# EAGLE design modular_expansion_system_base (EAGLE 9.2.1)
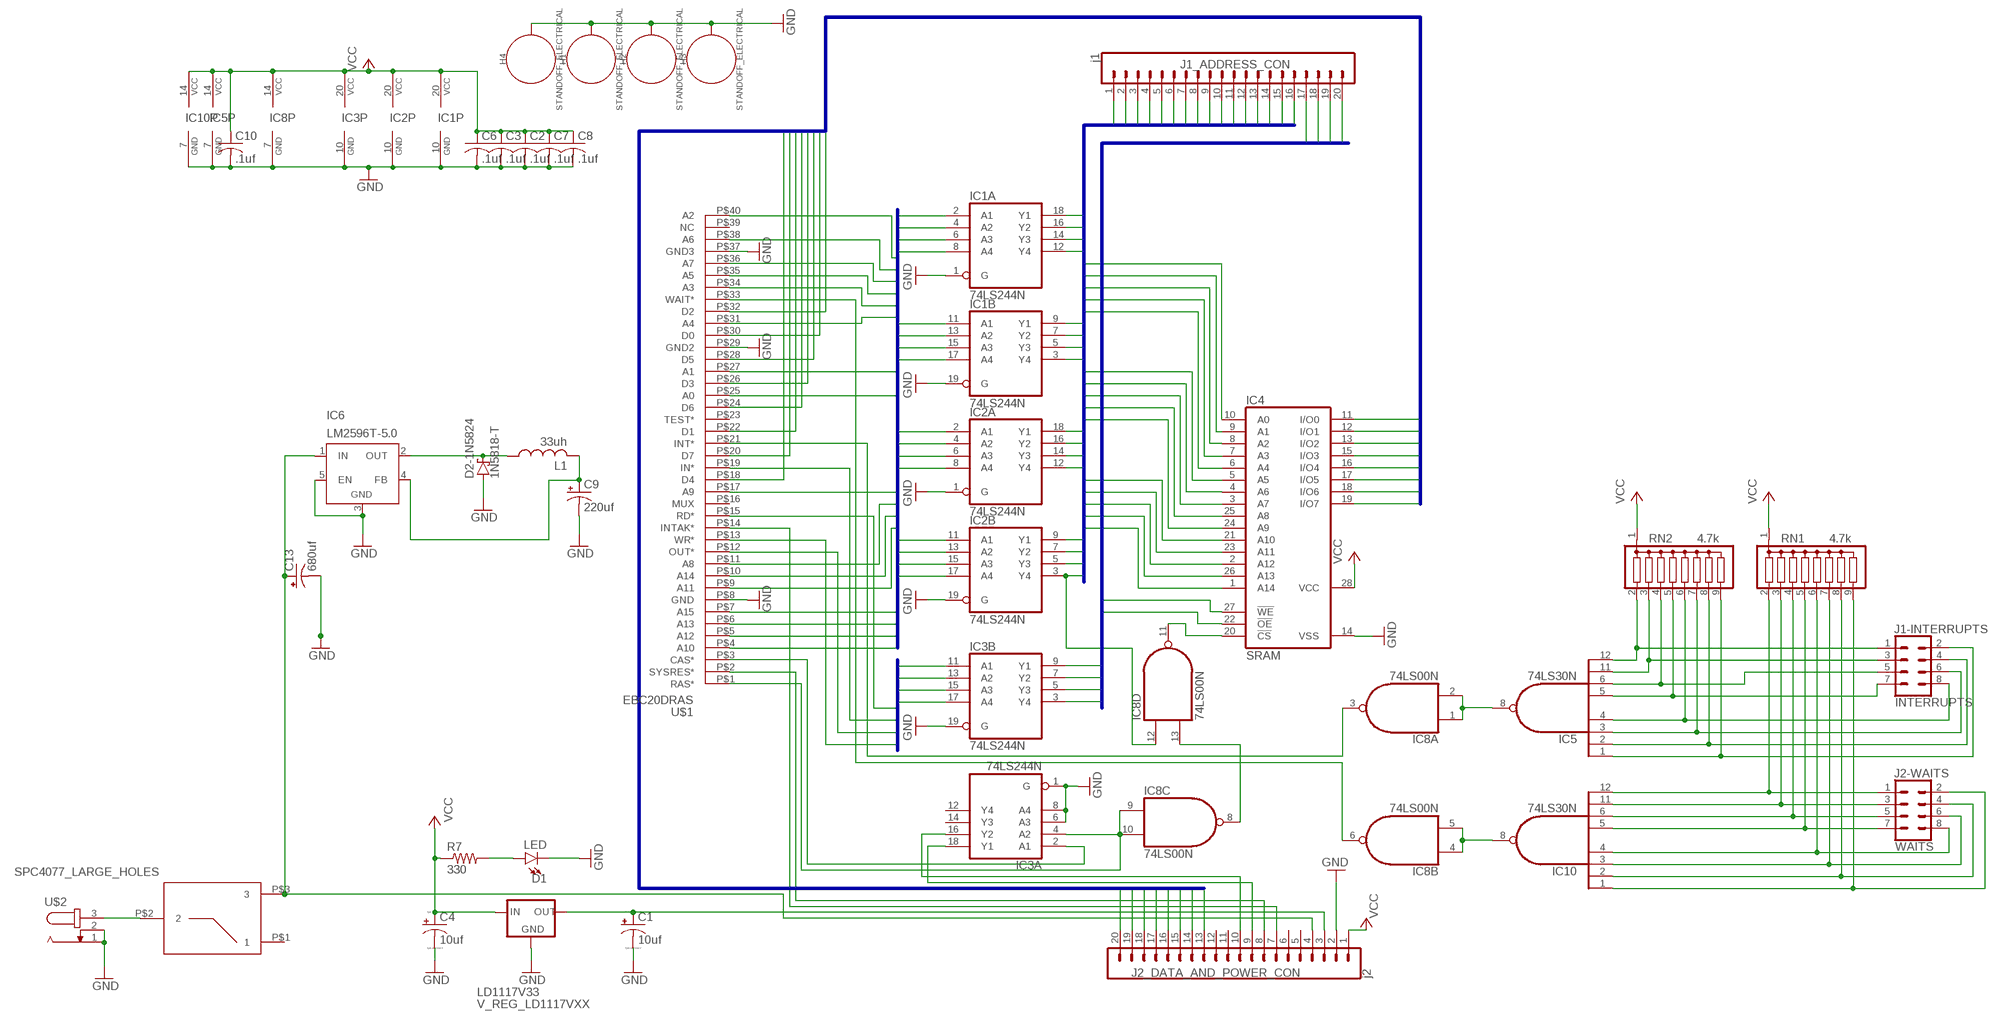
[diagram p0: schematic, sheet 1]

## Parts
C1  10uf  CPOL-USE2.5-5  [E2,5-5]
C2  .1uf  C-US025-025X050  [C025-025X050]
C3  .1uf  C-US025-025X050  [C025-025X050]
C4  10uf  CPOL-USE2.5-5  [E2,5-5]
C6  .1uf  C-US025-025X050  [C025-025X050]
C7  .1uf  C-US025-025X050  [C025-025X050]
C8  .1uf  C-US025-025X050  [C025-025X050]
C9  220uf  CPOL-USE2.5-5  [E2,5-5]
C10  .1uf  C-US025-025X050  [C025-025X050]
C13  680uf  CPOL-USE3.5-8  [E3,5-8]
D1  LED  LED3MM  [LED_3MM]
D2-1N5824  1N5818-T  [DO41-7.6]
H1  STANDOFF_ELECTRICAL  [STANDOFF-ELECTRICAL]
H2  STANDOFF_ELECTRICAL  [STANDOFF-ELECTRICAL]
H3  STANDOFF_ELECTRICAL  [STANDOFF-ELECTRICAL]
H4  STANDOFF_ELECTRICAL  [STANDOFF-ELECTRICAL]
IC1  74LS244N  [DIL20]
IC2  74LS244N  [DIL20]
IC3  74LS244N  [DIL20]
IC4  SRAM  62256P  [DIL28-6]
IC5  74LS30N  [DIL14]
IC6  LM2596T-5.0  LM2596TH  [TO220-52]
IC8  74LS00N  [DIL14]
IC10  74LS30N  [DIL14]
J1-INTERRUPTS  INTERRUPTS  CONN_04X2  [2X4]
J1_ADDRESS_CON  j1  CONN_20  [1X20]
J2-WAITS  WAITS  CONN_04X2  [2X4]
J2_DATA_AND_POWER_CON  j2  CONN_20  [1X20]
L1  33uh  L-US6000-XXX-RC  [6000-XXXX-RC]
LD1117V33  V_REG_LD1117VXX  [78XXL]
R7  330  R-US_0309/V  [0309V]
RN1  4.7k  G08R  [SIL9]
RN2  4.7k  G08R  [SIL9]
SW1  100SP3T1B1M6QE  [100SP3T1B1M6QE]
U$1  EBC20DRAS  [EBC20DRAS]
U$2  SPC4077_LARGE_HOLES  [SPC4077]

## Nets
5V_FROM_SWITCHER: C9.+ IC6.4(FB) L1.2
9V-IN: SW1.P$2 U$2.3
9V-POST-SW: C13.+ IC6.1(IN) J2_DATA_AND_POWER_CON.4 SW1.P$3
A0: IC1.2(A:A1) U$1.P$25(A0)
A1: IC1.4(A:A2) U$1.P$27(A1)
A2: IC1.6(A:A3) U$1.P$40(A2)
A3: IC1.8(A:A4) U$1.P$34(A3)
A4: IC1.11(B:A1) U$1.P$31(A4)
A5: IC1.13(B:A2) U$1.P$35(A5)
A6: IC1.15(B:A3) U$1.P$38(A6)
A7: IC1.17(B:A4) U$1.P$36(A7)
A8: IC2.2(A:A1) U$1.P$11(A8)
A9: IC2.4(A:A2) U$1.P$17(A9)
A10: IC2.6(A:A3) U$1.P$4(A10)
A11: IC2.8(A:A4) U$1.P$9(A11)
A12: IC2.11(B:A1) U$1.P$5(A12)
A13: IC2.13(B:A2) U$1.P$6(A13)
A14: IC2.15(B:A3) U$1.P$10(A14)
A15: IC2.17(B:A4) U$1.P$7(A15)
A15_AND_RAS: IC4.20(!CS) IC8.11(D:O)
BUFFERED_A0: IC1.18(A:Y1) IC4.10(A0) J1_ADDRESS_CON.1
BUFFERED_A1: IC1.16(A:Y2) IC4.9(A1) J1_ADDRESS_CON.2
BUFFERED_A2: IC1.14(A:Y3) IC4.8(A2) J1_ADDRESS_CON.3
BUFFERED_A3: IC1.12(A:Y4) IC4.7(A3) J1_ADDRESS_CON.4
BUFFERED_A4: IC1.9(B:Y1) IC4.6(A4) J1_ADDRESS_CON.5
BUFFERED_A5: IC1.7(B:Y2) IC4.5(A5) J1_ADDRESS_CON.6
BUFFERED_A6: IC1.5(B:Y3) IC4.4(A6) J1_ADDRESS_CON.7
BUFFERED_A7: IC1.3(B:Y4) IC4.3(A7) J1_ADDRESS_CON.8
BUFFERED_A8: IC2.18(A:Y1) IC4.25(A8) J1_ADDRESS_CON.9
BUFFERED_A9: IC2.16(A:Y2) IC4.24(A9) J1_ADDRESS_CON.10
BUFFERED_A10: IC2.14(A:Y3) IC4.21(A10) J1_ADDRESS_CON.11
BUFFERED_A11: IC2.12(A:Y4) IC4.23(A11) J1_ADDRESS_CON.12
BUFFERED_A12: IC2.9(B:Y1) IC4.2(A12) J1_ADDRESS_CON.13
BUFFERED_A13: IC2.7(B:Y2) IC4.26(A13) J1_ADDRESS_CON.14
BUFFERED_A14: IC2.5(B:Y3) IC4.1(A14) J1_ADDRESS_CON.15
BUFFERED_A15: IC2.3(B:Y4) IC8.12(D:I0) J1_ADDRESS_CON.16
BUFFERED_CAS*: IC3.18(A:Y1) J2_DATA_AND_POWER_CON.9
BUFFERED_IN*: IC3.5(B:Y3) J1_ADDRESS_CON.17
BUFFERED_OUT*: IC3.3(B:Y4) J1_ADDRESS_CON.18
BUFFERED_RAS*: IC3.16(A:Y2) J2_DATA_AND_POWER_CON.10
BUFFERED_RD*: IC3.9(B:Y1) IC4.22(!OE) J1_ADDRESS_CON.19
BUFFERED_WR*: IC3.7(B:Y2) IC4.27(!WE) J1_ADDRESS_CON.20
CAS*: IC3.2(A:A1) U$1.P$3(CAS*)
D0: IC4.11(I/O0) J2_DATA_AND_POWER_CON.20 U$1.P$30(D0)
D1: IC4.12(I/O1) J2_DATA_AND_POWER_CON.19 U$1.P$22(D1)
D2: IC4.13(I/O2) J2_DATA_AND_POWER_CON.18 U$1.P$32(D2)
D3: IC4.15(I/O3) J2_DATA_AND_POWER_CON.17 U$1.P$26(D3)
D4: IC4.16(I/O4) J2_DATA_AND_POWER_CON.16 U$1.P$18(D4)
D5: IC4.17(I/O5) J2_DATA_AND_POWER_CON.15 U$1.P$28(D5)
D6: IC4.18(I/O6) J2_DATA_AND_POWER_CON.14 U$1.P$24(D6)
D7: IC4.19(I/O7) J2_DATA_AND_POWER_CON.13 U$1.P$20(D7)
GND: C1.- C2.2 C3.2 C4.- C6.2 C7.2 C8.2 C9.- C10.2 C13.- D1.K(C) D2-1N5824.A H1.P1 H2.P1 H3.P1 H4.P1 IC1.1(A:G) IC1.10(P:GND) IC1.19(B:G) IC2.1(A:G) IC2.10(P:GND) IC2.19(B:G) IC3.1(A:G) IC3.6(A:A3) IC3.8(A:A4) IC3.10(P:GND) IC3.19(B:G) IC4.14(VSS) IC5.7(GND) IC6.3(GND) IC6.5(EN) IC8.7(P:GND) IC10.7(GND) J2_DATA_AND_POWER_CON.2 LD1117V33.IN(GND) U$1.P$8(GND) U$1.P$29(GND2) U$1.P$37(GND3) U$2.1 U$2.2
IN*: IC3.15(B:A3) U$1.P$19(IN*)
INT: IC5.8(O) IC8.1(A:I0) IC8.2(A:I1)
INT0*: IC5.12(I7) J1-INTERRUPTS.1 RN2.2
INT1*: IC5.11(I6) J1-INTERRUPTS.3 RN2.3
INT2*: IC5.6(I5) J1-INTERRUPTS.5 RN2.4
INT3*: IC5.5(I4) J1-INTERRUPTS.7 RN2.5
INT4*: IC5.1(I0) J1-INTERRUPTS.2 RN2.9
INT5*: IC5.2(I1) J1-INTERRUPTS.4 RN2.8
INT6*: IC5.3(I2) J1-INTERRUPTS.6 RN2.7
INT7*: IC5.4(I3) J1-INTERRUPTS.8 RN2.6
INT*: IC8.3(A:O) U$1.P$21(INT*)
INTAK*: J2_DATA_AND_POWER_CON.7 U$1.P$14(INTAK*)
N$1: D2-1N5824.C IC6.2(OUT) L1.1
N$20: D1.A R7.2
OUT*: IC3.17(B:A4) U$1.P$12(OUT*)
RAS: IC8.8(C:O) IC8.13(D:I1)
RAS*: IC3.4(A:A2) IC8.9(C:I0) IC8.10(C:I1) U$1.P$1(RAS*)
RD*: IC3.11(B:A1) U$1.P$15(RD*)
SYSRES*: J2_DATA_AND_POWER_CON.8 U$1.P$2(SYSRES*)
VCC: C2.1 C3.1 C4.+ C6.1 C7.1 C8.1 C10.1 IC1.20(P:VCC) IC2.20(P:VCC) IC3.20(P:VCC) IC4.28(VCC) IC5.14(VCC) IC8.14(P:VCC) IC10.14(VCC) J2_DATA_AND_POWER_CON.1 LD1117V33.OUT(IN) R7.1 RN1.1 RN2.1
VCC/2: C1.+ J2_DATA_AND_POWER_CON.3 LD1117V33.GND(OUT)
WAIT: IC8.4(B:I0) IC8.5(B:I1) IC10.8(O)
WAIT0*: IC10.4(I3) J2-WAITS.8 RN1.6
WAIT1*: IC10.3(I2) J2-WAITS.6 RN1.7
WAIT2*: IC10.2(I1) J2-WAITS.4 RN1.8
WAIT3*: IC10.1(I0) J2-WAITS.2 RN1.9
WAIT4*: IC10.5(I4) J2-WAITS.7 RN1.5
WAIT5*: IC10.6(I5) J2-WAITS.5 RN1.4
WAIT6*: IC10.11(I6) J2-WAITS.3 RN1.3
WAIT7*: IC10.12(I7) J2-WAITS.1 RN1.2
WAIT*: IC8.6(B:O) U$1.P$33(WAIT*)
WR*: IC3.13(B:A2) U$1.P$13(WR*)
Unconnected: IC3.12(A:Y4) IC3.14(A:Y3) J2_DATA_AND_POWER_CON.5 J2_DATA_AND_POWER_CON.6 J2_DATA_AND_POWER_CON.11 J2_DATA_AND_POWER_CON.12 SW1.P$1 U$1.P$16(MUX) U$1.P$23(TEST*) U$1.P$39(NC)

## Buses
DATABUS:D0,D1,D2,D3,D4,D5,D6,D7
CNTRL:IN*,OUT*,RD*,WR*
CONTROL:BUFFERED_IN*,BUFFERED_OUT*,BUFFERED_RD*,BUFFERED_WR*
BUFFERED:BUFFERED_A0,BUFFERED_A1,BUFFERED_A2,BUFFERED_A3,BUFFERED_A4,BUFFERED_A5,BUFFERED_A6,BUFFERED_A7,BUFFERED_A8,BUFFERED_A9,BUFFERED_A10,BUFFERED_A11,BUFFERED_A12,BUFFERED_A13,BUFFERED_A14,BUFFERED_A15
A0,A1,A2,A3,A4,A5,A6,A7,A8,A9,A10,A11,A12,A13,A14,A15

## Library data of the parts
C1 C4 = resistor:CPOL-US: POLARIZED CAPACITOR, American symbol
C2 C3 C6-C8 C10 = rcl:C-US: CAPACITOR, American symbol; SPICEPREFIX: C
C9 C13 = rcl:CPOL-US: POLARIZED CAPACITOR, American symbol; SPICEPREFIX: C
D1 = SparkFun-LED:LED: LED (Generic) Standard schematic elements and footprints for 5mm, 3mm, 1206, and 0603 sized LEDs. Generic LEDs with no color specified.; PROD_ID: DIO-08794
D2-1N5824 = diode:1N581*: 1.0A SCHOTTKY BARRIER RECTIFIER Source: http://www.diodes.com/datasheets/ds23001.pdf
H1-H4 = SparkFun-Hardware:STANDOFF_ELECTRICAL: Stand Off Drill holes with an electrical connection. For example, use these to ground your board to a chassis. Example SparkFun Products Screw - Phillips Head (1/4", 4-40, 10 pack) <https://www.sparkfun.com/products/10453> (PRT-10453) Screw - Phillips Head (1/2", 4-40, 10 pack) <https://www.sparkfun.com/products/10452> (PRT-10452) Screw - Phillips Head (3/4", 4-40, 10 pack) <https://www.sparkfun.com/products/10451> (PRT-10451) Screw - Phillips Head (1", 4-40, 10 pack) <https://www.sparkfun.com/products/10450> (PRT-10450)
IC1-IC3 = 74xx-us:74*244: Octal BUFFER and LINE DRIVER, 3-state
IC4 = memory-hitachi:62256P: MEMORY; OC_FARNELL: unknown; OC_NEWARK: unknown
IC5 IC10 = 74xx-us:74*30: 8-input NAND gate
IC6 = linear:LM2596T: STEP-DOWN VOLTAGE REGULATOR
IC8 = 74xx-us:74*00: Quad 2-input NAND gate
J1-INTERRUPTS J2-WAITS = SparkFun-Connectors:CONN_04X2: Multi connection point. Often used as Generic Header-pin footprint for 0.1 inch spaced/style header connections On any of the 0.1 inch spaced packages, you can populate with these: Break Away Headers - Straight <https://www.sparkfun.com/products/116> (PRT-00116) Break Away Male Headers - Right Angle <https://www.sparkfun.com/products/553> (PRT-00553) Female Headers <https://www.sparkfun.com/products/115> (PRT-00115) Break Away Headers - Machine Pin <https://www.sparkfun.com/products/117> (PRT-00117) Break Away Female Headers - Swiss Machine Pin <https://www.sparkfun.com/products/743> (PRT-00743)
J1_ADDRESS_CON J2_DATA_AND_POWER_CON = SparkFun-Connectors:CONN_20: Multi connection point. Often used as Generic Header-pin footprint for 0.1 inch spaced/style header connections On any of the 0.1 inch spaced packages, you can populate with these: Break Away Headers - Straight <https://www.sparkfun.com/products/116> (PRT-00116) Break Away Male Headers - Right Angle <https://www.sparkfun.com/products/553> (PRT-00553) Female Headers <https://www.sparkfun.com/products/115> (PRT-00115) Break Away Headers - Machine Pin <https://www.sparkfun.com/products/117> (PRT-00117) Break Away Female Headers - Swiss Machine Pin <https://www.sparkfun.com/products/743> (PRT-00743) For SCREWTERMINALS and SPRING TERMINALS visit here: Screw Terimnals on SparkFun.com <https://www.sparkfun.com/search/results?term=Screw+Terminals> (5mm/3.5mm/2.54mm spacing) This device is also useful as a general connection point to wire up your design to another part of your project. Our various solder wires solder well into these plated through hole pads. Hook-Up Wire - Assortment (Stranded, 22 AWG) <https://www.sparkfun.com/products/11375> (PRT-11375) Hook-Up Wire - Assortment (Solid Core, 22 AWG) <https://www.sparkfun.com/products/11367> (PRT-11367) View the entire wire category on our website here <https://www.sparkfun.com/categories/141> Special notes: Molex polarized connector foot print use with SKU : PRT-08231 with associated crimp pins and housings. 1MM SMD Version SKU: PRT-10208 NOTES ON THE VARIANTS LOCK and LOCK_LONGPADS... This footprint was designed to help hold the alignment of a through-hole component (i.e. 6-pin header) while soldering it into place. You may notice that each hole has been shifted either up or down by 0.005 of an inch from it's more standard position (which is a perfectly straight line). This slight alteration caused the pins (the squares in the middle) to touch the edges of the holes. Because they are alternating, it causes a "brace" to hold the component in place. 0.005 has proven to be the perfect amount of "off-center" position when using our standard breakaway headers. Although looks a little odd when you look at the bare footprint, once you have a header in there, the alteration is very hard to notice. Also,if you push a header all the way into place, it is covered up entirely on the bottom side. Note about LOCK SPECIAL package: This is just like the LOCK variant in that the holes are staggared by 5 mil, but except for the last two holes. They are not altered from the "standard" footprint layout. This is used for a special purpose on the layout of our Graphic LCD Backpack. Make sure you want to use this device before selecting it for you project!
L1 = rcl:L-US: INDUCTOR, American symbol; SPICEPREFIX: L
LD1117V33 = SparkFun-IC-Power:V_REG_LD1117VXX: LD1117VXX voltage regulator. We carry the 3.3V version (COM-00526) in TO-220 package.
R7 = resistor:R-US_: RESISTOR, American symbol
RN1 RN2 = resistor-sil:G08R: SIL RESISTOR; OC_FARNELL: unknown; OC_NEWARK: unknown
SW1 = TMS99:100SP3T1B1M6QE
U$1 = TMS99:EBC20DRAS
U$2 = con-jack:SPC4077_LARGE_HOLES

## Net classes
0 default: width 0.3 mm

## Board
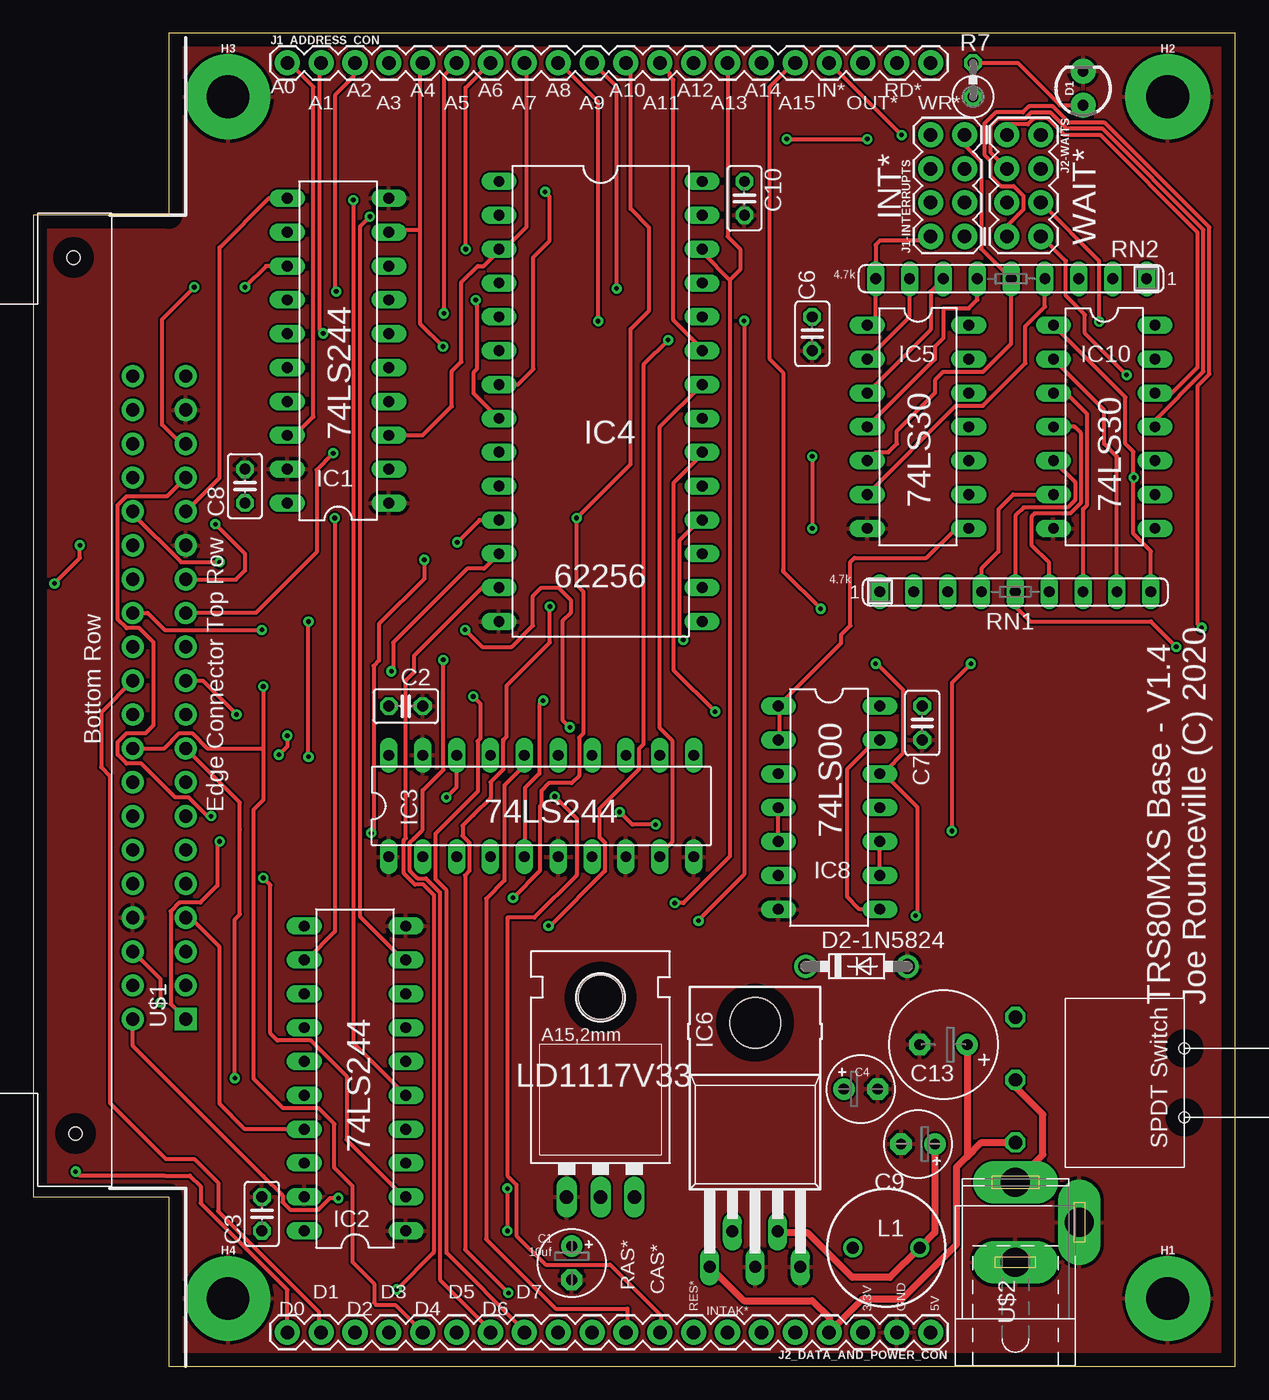
[diagram p1: board, top side]
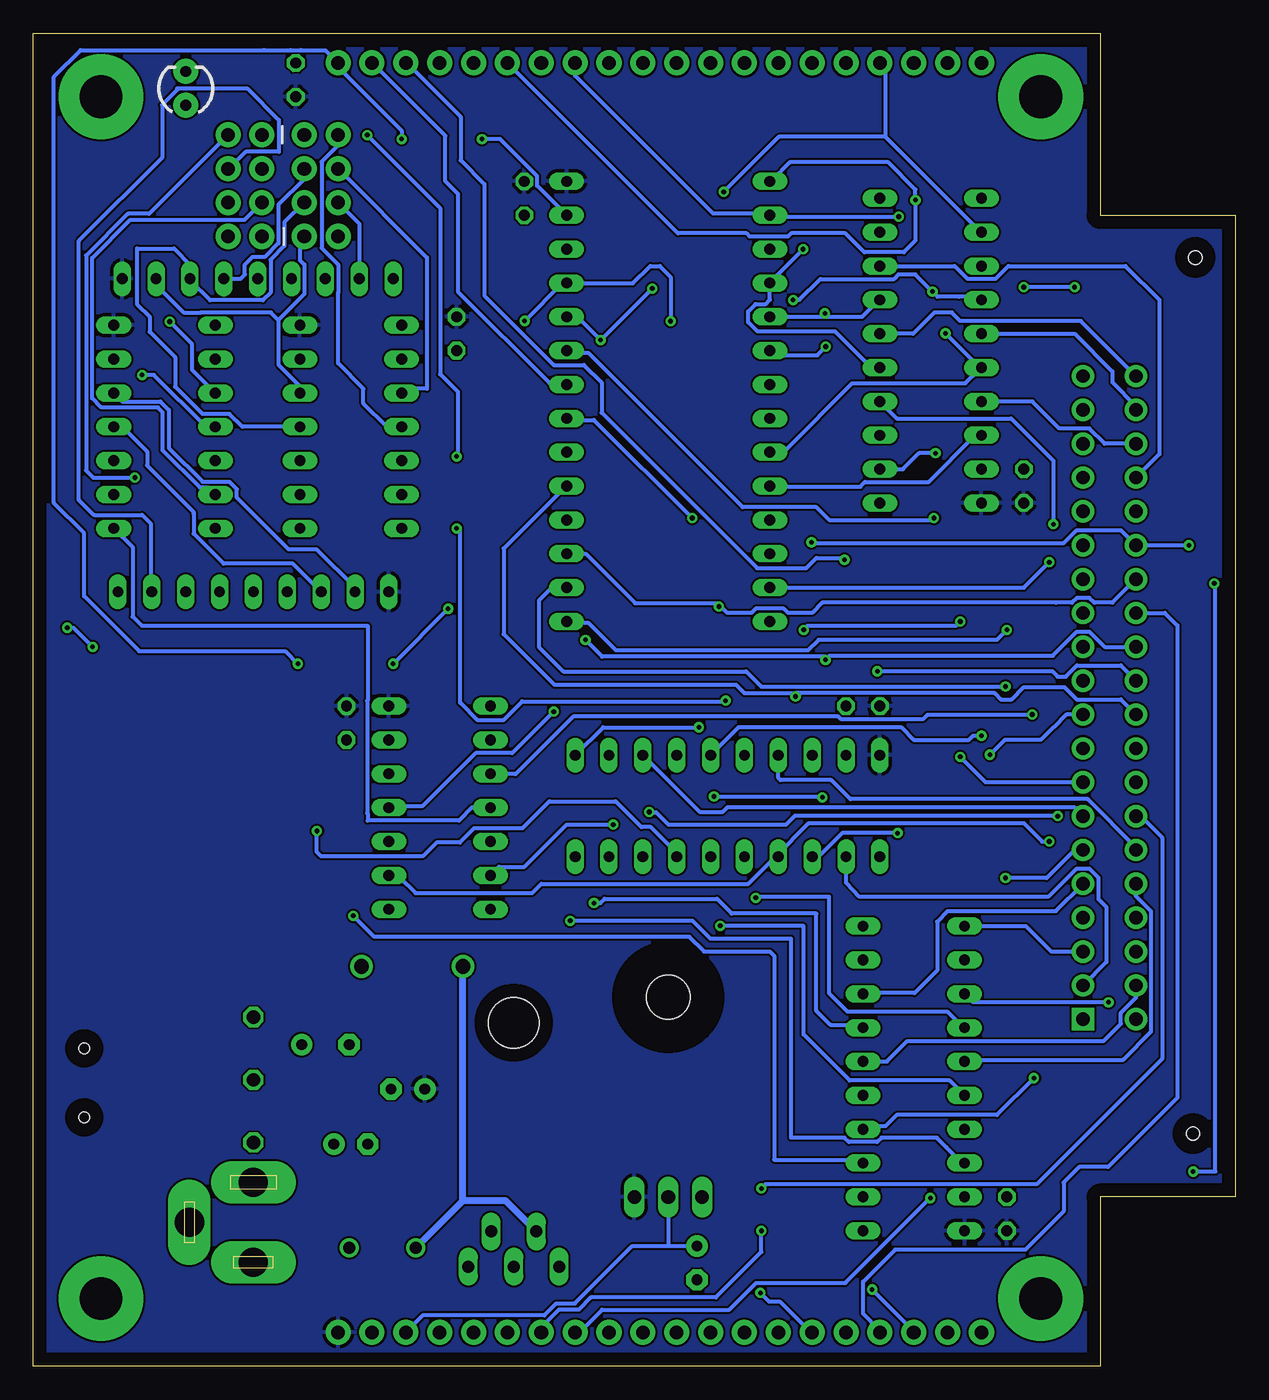
[diagram p2: board, bottom side, seen from below]

Size 90.17 x 100.01 mm. Coordinates in mm from the lower left corner, seen from the top.
Outline: 90.17,100.01 10.16,100.01 10.16,86.36 0,86.36 0,12.7 10.16,12.7 10.16,0 90.17,0 90.17,100.01
Copper layers (1*16): Top 0.035mm / dielectric 1.5mm / Bottom 0.035mm
Design rules "default": minimum track width 6mil, minimum drill 0.35mm, track to track 6mil, track to pad 6mil, pad to pad 6mil, via to via 6mil, smd to smd 6mil, copper to edge 40mil, drill to drill 6mil, minimum pad ring 10mil, minimum via ring 8mil, stop-mask expansion 4mil, vias tented up to drill 0mil, thermal gap 10mil

### Footprints (pad centres in the part's own frame; a part is rotated, then mirrored left to right if it is on the bottom)
E2,5-5 = drill 0.813 pad 1.6: + -1.27,0 | drill 0.813 pad 1.6 octagon: - 1.27,0
C025-025X050 = drill 0.813 octagon: 1 -1.27,0; 2 1.27,0
E3,5-8 = drill 0.813 pad 1.6: + -1.778,0 | drill 0.813 pad 1.6 octagon: - 1.778,0
LED_3MM = drill 0.813 pad 1.88: A -1.27,0; K 1.27,0
DO41-7.6 = drill 1.1 pad 1.7: A 3.81,0; C -3.81,0
STANDOFF-ELECTRICAL = drill 3.2 pad 6.35: P1 0,0
DIL20 = drill 0.813 long: 1 -11.43,-3.81; 2 -8.89,-3.81; 3 -6.35,-3.81; 4 -3.81,-3.81; 5 -1.27,-3.81; 6 1.27,-3.81; 7 3.81,-3.81; 8 6.35,-3.81; 9 8.89,-3.81; 10 11.43,-3.81; 11 11.43,3.81; 12 8.89,3.81; 13 6.35,3.81; 14 3.81,3.81; 15 1.27,3.81; 16 -1.27,3.81; 17 -3.81,3.81; 18 -6.35,3.81; 19 -8.89,3.81; 20 -11.43,3.81
DIL28-6 = drill 0.813 long: 1 -16.51,-7.62; 2 -13.97,-7.62; 3 -11.43,-7.62; 4 -8.89,-7.62; 5 -6.35,-7.62; 6 -3.81,-7.62; 7 -1.27,-7.62; 8 1.27,-7.62; 9 3.81,-7.62; 10 6.35,-7.62; 11 8.89,-7.62; 12 11.43,-7.62; 13 13.97,-7.62; 14 16.51,-7.62; 15 16.51,7.62; 16 13.97,7.62; 17 11.43,7.62; 18 8.89,7.62; 19 6.35,7.62; 20 3.81,7.62; 21 1.27,7.62; 22 -1.27,7.62; 23 -3.81,7.62; 24 -6.35,7.62; 25 -8.89,7.62; 26 -11.43,7.62; 27 -13.97,7.62; 28 -16.51,7.62
DIL14 = drill 0.813 long: 1 -7.62,-3.81; 2 -5.08,-3.81; 3 -2.54,-3.81; 4 0,-3.81; 5 2.54,-3.81; 6 5.08,-3.81; 7 7.62,-3.81; 8 7.62,3.81; 9 5.08,3.81; 10 2.54,3.81; 11 0,3.81; 12 -2.54,3.81; 13 -5.08,3.81; 14 -7.62,3.81
TO220-52 = drill 0.9 long: 1 -3.4,-21.1; 2 -1.7,-18.47; 3 0,-21.1; 4 1.7,-18.47; 5 3.4,-21.1 | hole 3.8: 0,-2.8
2X4 = drill 1.016 pad 1.88: 1 -3.81,-1.27; 2 -3.81,1.27; 3 -1.27,-1.27; 4 -1.27,1.27; 5 1.27,-1.27; 6 1.27,1.27; 7 3.81,-1.27; 8 3.81,1.27
1X20 = drill 1.016 pad 1.88: 1 0,0; 2 2.54,0; 3 5.08,0; 4 7.62,0; 5 10.16,0; 6 12.7,0; 7 15.24,0; 8 17.78,0; 9 20.32,0; 10 22.86,0; 11 25.4,0; 12 27.94,0; 13 30.48,0; 14 33.02,0; 15 35.56,0; 16 38.1,0; 17 40.64,0; 18 43.18,0; 19 45.72,0; 20 48.26,0
6000-XXXX-RC = drill 0.9 pad 1.422: 1 -2.5,0; 2 2.5,0
78XXL = drill 1.016 long: GND 0,-3.81; IN -2.54,-3.81; OUT 2.54,-3.81 | hole 3.302: 0,11.176
0309V = drill 0.813 octagon: 1 -1.27,0; 2 1.27,0
SIL9 = drill 0.813 long: 1 -10.16,0; 2 -7.62,0; 3 -5.08,0; 4 -2.54,0; 5 0,0; 6 2.54,0; 7 5.08,0; 8 7.62,0; 9 10.16,0
100SP3T1B1M6QE = drill 1 octagon: P$1 0,-0.47; P$2 0,4.229; P$3 0,8.928 | hole 0.8: -12.687,7.048; -12.687,1.88
EBC20DRAS = drill 1 pad 1.676 square: P$1 0,0 | drill 1 pad 1.676: P$2 0,3.969; P$3 2.54,0; P$4 2.54,3.969; P$5 5.08,0; P$6 5.08,3.969; P$7 7.62,0; P$8 7.62,3.969; P$9 10.16,0; P$10 10.16,3.969; P$11 12.7,0; P$12 12.7,3.969; P$13 15.24,0; P$14 15.24,3.969; P$15 17.78,0; P$16 17.78,3.969; P$17 20.32,0; P$18 20.32,3.969; P$19 22.86,0; P$20 22.86,3.969; P$21 25.4,0; P$22 25.4,3.969; P$23 27.94,0; P$24 27.94,3.969; P$25 30.48,0; P$26 30.48,3.969; P$27 33.02,0; P$28 33.02,3.969; P$29 35.56,0; P$30 35.56,3.969; P$31 38.1,0; P$32 38.1,3.969; P$33 40.64,0; P$34 40.64,3.969; P$35 43.18,0; P$36 43.18,3.969; P$37 45.72,0; P$38 45.72,3.969; P$39 48.26,0; P$40 48.26,3.969 | hole 1: -8.572,8.255; 57.15,8.414
SPC4077 = drill 2.184 pad 2.184 long: 1 -3,0; 2 0,-4.8; 3 3,0

### Placement (x,y rotation side)
C1  40.39,7.75 270 top
C2  27.94,49.53 0 top
C3  17.14,11.43 90 top
C4  62.07,20.8 0 top
C6  58.42,77.47 270 top
C7  66.67,48.26 270 top
C8  15.88,66.04 90 top
C9  66.36,16.67 180 top
C10  53.34,87.63 270 top
C13  68.26,24.13 180 top
D1  78.74,95.89 90 top
D2-1N5824  61.75,30 0 top
H1  85.09,5.08 0 top
H2  85.09,95.25 0 top
H3  14.61,95.25 0 top
H4  14.61,5.08 0 top
IC1  22.86,76.2 90 top
IC2  24.13,21.59 90 top
IC3  38.1,42.04 0 top
IC4  42.55,72.39 270 top
IC5  66.36,70.48 270 top
IC6  54.13,28.57 0 top
IC8  59.69,41.91 270 top
IC10  80.33,70.48 270 top
J1-INTERRUPTS  68.58,88.58 90 top
J1_ADDRESS_CON  19.05,97.79 0 top
J2-WAITS  74.3,88.58 270 top
J2_DATA_AND_POWER_CON  67.31,2.54 180 top
L1  63.98,8.89 0 top
LD1117V33  42.55,16.51 0 top
R7  70.48,96.52 90 top
RN1  73.66,58.1 0 top
RN2  73.34,81.6 180 top
SW1  73.66,25.72 180 top
U$1  11.43,26.04 90 top
U$2  73.66,10.79 90 top

### Tracks (layer width: path | path; a pad name or v marks a point on that pad's centre or on a via)
5V_FROM_SWITCHER
  Top 0.508: C9.+ 67.63,10.04 L1.2 64.25,6.67 61.44,6.67 58.1,10 55.94,10 IC6.4
9V-IN
  Top 0.508: U$2.3 75.72,15.86 75.72,18.89 73.66,20.95 SW1.P$2
9V-POST-SW
  Top 0.508: IC6.1 53.29,4.92 58.42,4.92 59.69,3.65 J2_DATA_AND_POWER_CON.4 62.2,5.05 65.17,5.05 69.26,9.14 69.26,14.94 70.02,15.71 70.04,15.72 | SW1.P$3 71.11,16.79 70.04,15.72 | C13.+ 70.04,15.72
A0  (via drill 0.35)
  Top 0.3: v22.5,68.5 21.25,67.25 21.25,61.08 16.69,56.52 U$1.P$25
  Bottom 0.3: IC1.2 24.94,67.31 23.75,68.5 v22.5,68.5
A1  (via drill 0.35)
  Top 0.3: U$1.P$27 11.48,59.01 15.19,59.01 15.88,59.69 15.88,60.96 v13.65,63.18
  Bottom 0.3: IC1.4 25.4,71.12 16.83,71.12 13.65,67.94 v13.65,63.18
A2
  Bottom 0.3: IC1.6 24.17,77.47 22.58,79.06 21.27,79.06 20.65,78.43 11.6,78.43 U$1.P$40
A3
  Bottom 0.3: IC1.8 21.07,82.55 20.11,81.59 17.99,81.59 17.03,82.55 8.26,82.55 5.71,80.01 5.71,68.42 U$1.P$34
A4
  Top 0.3: U$1.P$31 13.97,66.67 13.97,83.94 17.66,87.63 IC1.11
A5  (via drill 0.35)
  Top 0.3: U$1.P$35 11.09,69.22 9.65,70.65 9.65,78.55 v12.06,80.96 | IC1.13 17.46,82.55 v15.88,80.96
  Bottom 0.3: v12.06,80.96 v15.88,80.96
A6
  Bottom 0.3: IC1.15 12.06,77.47 9.24,74.64 9.24,73.82 7.46,72.05 U$1.P$38
A7
  Bottom 0.3: U$1.P$36 9.82,69.22 10.96,70.36 13.21,70.36 15.24,72.39 IC1.17
A8  (via drill 0.35)
  Top 0.3: 21.25,24 23.5,21.75 23.5,17 27.75,12.75 IC2.2
  Top 0.305: 21.25,24 20.82,24.43 18.31,24.43 17.78,24.96 17.78,36.1 v17.25,36.63
  Bottom 0.3: U$1.P$11 12.06,38.73 14.16,36.63 v17.25,36.63
A9  (via drill 0.35)
  Top 0.3: 15.49,40.26 15.49,42.29 U$1.P$17
  Top 0.305: v15.12,21.61 15.12,33.53 15.49,33.91 15.49,40.26
  Bottom 0.3: v15.12,21.61 17.89,18.84 25.41,18.84 26.25,18 27.75,18 IC2.4
A10
  Bottom 0.3: U$1.P$4 7.46,27.65 8.6,26.51 8.6,25.69 9.88,24.41 24.61,24.41 26.16,22.86 IC2.6
A11
  Bottom 0.3: 27.75,28 IC2.8 | 15.38,34.15 13.48,34.15 U$1.P$9
  Bottom 0.305: 27.75,28 24.07,28 22.38,29.69 22.38,33.34 21.57,34.15 15.38,34.15
A12
  Bottom 0.3: U$1.P$5 13.81,31.11 15.72,33.02 IC2.11
A13  (via drill 0.35)
  Top 0.3: U$1.P$6 9.53,29.05 v9.53,27.3
  Bottom 0.3: v9.53,27.3 19.68,27.3 IC2.13
A14
  Bottom 0.3: IC2.15 20.25,23 8.43,23 6.32,25.11 6.32,34.13 7.46,35.27 U$1.P$10
A15
  Top 0.3: 13.97,19.68 13.97,31.46 11.77,33.66 U$1.P$7
  Top 0.305: IC2.17 15.88,17.78 13.97,19.68
A15_AND_RAS  (via drill 0.35)
  Top 0.3: v51.13,49.12 48,52.25 48,66.25 50,68.25 50,68.5 IC4.20
  Bottom 0.3: v51.13,49.12 54.25,46 57,46 61,42 63.5,42 IC8.11
BUFFERED_A0
  Top 0.3: J1_ADDRESS_CON.1 19.25,97.75 21,96 21,71.25 19.75,70 19.25,70 IC1.18
  Bottom 0.3: IC4.10 34.75,66 28.14,66 27.79,66.35 23.02,66.35 19.61,69.75 19.25,69.75 IC1.18
BUFFERED_A1  (via drill 0.35)
  Top 0.3: v21.75,77.5 21.5,77.75 21.5,97.75 J1_ADDRESS_CON.2
  Bottom 0.3: IC4.9 34.75,68.75 33.75,68.75 28.75,73.75 20.25,73.75 19.25,74.75 IC1.16 19.25,75 v21.75,77.5
BUFFERED_A2  (via drill 0.35)
  Top 0.3: 22.61,81.92 22.61,95.36 24,96.75 24,97.75 J1_ADDRESS_CON.3 | v33.18,80 33.25,79.93 33.25,74.8 33,74.55 33,73 34.75,71.25 IC4.8
  Top 0.305: 22.61,81.92 22.61,80.75 v22.73,80.64
  Bottom 0.3: 20.75,80.25 19.25,80.25 IC1.14 | v33.18,80.01 32.7,80.01 31.13,81.58 31.11,81.58
  Bottom 0.305: 20.75,80.25 22.34,80.25 v22.73,80.64 24,81.92 25.28,81.92 25.61,81.58 31.11,81.58 | v33.18,80.01 v33.18,80
BUFFERED_A3  (via drill 0.35)
  Top 0.3: 37.5,74.82 36.34,73.66 IC4.7
  Top 0.305: 37.5,74.82 37.5,83.22 38.73,84.45 38.73,87.77 v38.38,88.11
  Bottom 0.3: 26.25,92.25 19.25,85.25 IC1.12 | 26.25,92.25 26.25,97.75 26.5,97.75 J1_ADDRESS_CON.4 | v38.38,88.11 34.25,92.25 26.25,92.25
BUFFERED_A4  (via drill 0.35)
  Top 0.3: 29,85.25 26.75,85.25 IC1.9 | 29,85.25 29,97.75 J1_ADDRESS_CON.5 | v30.73,76.5 29,78.23 29,85.25
  Bottom 0.3: v30.73,76.5 31.36,75.86 34.59,75.86 IC4.6
BUFFERED_A5  (via drill 0.35)
  Top 0.3: J1_ADDRESS_CON.6 30.8,96.84 v30.8,79
  Bottom 0.3: 30.8,78.75 34.75,78.75 IC4.5 | 30.8,78.75 28,78.75 26.75,80 IC1.7 | 30.8,78.75 v30.8,79
BUFFERED_A6  (via drill 0.35)
  Top 0.3: J1_ADDRESS_CON.7 32.43,95.93 v32.43,83.82
  Bottom 0.3: IC1.5 27.32,74.93 30.04,77.66 35.87,77.66 36,77.79 | 35,81.25 IC4.4 34.75,81.5 v32.43,83.82
  Bottom 0.305: 36,77.79 36.55,78.34 36.55,79.14 35.98,79.7 35.23,79.7 34.92,80.01 34.92,81.17 35,81.25
BUFFERED_A7
  Top 0.3: J1_ADDRESS_CON.8 37,97.75 37,85.5 35.5,84 35,84 IC4.3 34.75,83.75 34.75,83.5 33.8,82.55 33.34,82.55 32.12,81.33 32.12,75.36 31.4,74.65 31.4,72.04 29.21,69.85 IC1.3
BUFFERED_A8  (via drill 0.35)
  Top 0.3: v42.37,78.42 42.37,94.89 39.5,97.75 J1_ADDRESS_CON.9 | 49.85,33.37 v49.89,33.42 49.89,33.46 53.32,36.89
  Top 0.305: v53.32,78.43 53.32,36.89
  Bottom 0.3: 21.68,16.43 20.5,15.25 IC2.18 | v53.32,78.43 50.5,81.25 50.25,81.25 IC4.25 50,81.25 45.2,81.25 | 33.34,17.14 33.34,32.07 39.37,32.07 40.72,33.42 v49.89,33.42
  Bottom 0.305: 45.2,81.25 43.9,82.55 43.18,82.55 42.37,81.73 v42.37,78.42 | 21.68,16.43 22.39,17.14 26.55,17.14 26.88,16.82 29,16.82 29.33,17.14 33.34,17.14
BUFFERED_A9  (via drill 0.35)
  Top 0.3: v47.62,77 45.75,75.14 45.75,46.66 45.41,46.32 45.41,44.78 42.45,41.82 42.45,39.71 42.87,39.29 42.87,37.16 38.76,33.05 v38.64,33.05 | v43.75,80.86 43.75,96 42,97.75 J1_ADDRESS_CON.10
  Bottom 0.3: IC2.16 21.43,21.43 28.93,21.43 32.38,24.89 32.38,33.02 38.62,33.02 v38.64,33.05 | IC4.24 50,78.5 49.12,78.5 v47.62,77 v43.75,80.86
BUFFERED_A10  (via drill 0.35)
  Top 0.3: v35.98,35.15 38,37.17 38,42 38.1,42.1 38.1,43.18 38.67,43.75 40.39,43.75 40.93,44.3 40.93,47.17 41.27,47.52 41.27,58.1 40.75,58.63 v40.75,63.63 44.8,67.68 44.8,77.82 46.2,79.22 46.2,85.44 44.8,86.84 44.8,97.45 44.5,97.75 J1_ADDRESS_CON.11
  Bottom 0.3: v40.75,63.63 48.12,71 50,71 IC4.21 | IC2.14 20.5,25.5 21.59,26.59 29.09,26.59 30.48,27.98 30.48,35.24 35.98,35.24 v35.98,35.15
BUFFERED_A11  (via drill 0.35)
  Top 0.3: v22.61,63.63 22.61,32.62 20.5,30.5 IC2.12 | J1_ADDRESS_CON.12 47,97.75 47.75,97 47.75,96.75 48,96.5 48,78.5 50,76.5 50,76.25 IC4.23
  Bottom 0.3: IC4.23 50,76 48.5,76 36.96,64.46 31.44,64.46 31.04,64.06
  Bottom 0.305: 31.04,64.06 30.48,63.5 22.75,63.5 v22.61,63.63
BUFFERED_A12  (via drill 0.35)
  Top 0.3: v25.25,86.25 24.5,85.5 24.5,33.75 27.75,30.5 IC2.9
  Bottom 0.3: v25.25,86.25 34.75,86.25 IC4.2 35,86.5 39.2,86.5 49.53,96.83 J1_ADDRESS_CON.13
BUFFERED_A13  (via drill 0.35)
  Top 0.3: v48.12,34.75 48.75,34.75 52.25,38.25 52.25,81.5 | 52.25,81.5 50.25,83.5 50.25,83.75 IC4.26 | J1_ADDRESS_CON.14 52.07,84.77 53.02,83.82 53.02,82.27 52.25,81.5
  Bottom 0.3: v48.12,34.75 47.64,34.75 47.32,35.07 38.88,35.07 37.79,33.97 31.44,33.97 31.44,26.67 30.39,25.61 28.11,25.61 28,25.5 IC2.7
BUFFERED_A14  (via drill 0.35)
  Top 0.3: v24,87.5 24,24.25 27.75,20.5 IC2.5
  Bottom 0.3: IC4.1 34.75,89 33.42,90.33 26.04,90.33 24,88.29 v24,87.5 24,84.46 24.86,83.59 27.84,83.59 29.25,85 | 33.34,85 33.55,84.78 36.45,84.78 36.67,85
  Bottom 0.305: 29.25,85 33.34,85 | J1_ADDRESS_CON.15 41.82,85 36.67,85
BUFFERED_A15  (via drill 0.35)
  Top 0.3: v66.18,33.79 66.29,33.91 66.29,41.96 64,44.25 | 64,44.25 63.5,44.25 IC8.12 64,44.25 | 56.25,97 57,97.75 J1_ADDRESS_CON.16 | 64,44.25 64,44.75 65.25,46 65.25,50.75 63.3,52.7 v63.18,52.7 | 56.25,59.75 56.25,59.64 v59.05,56.83
  Top 0.305: 56.25,59.75 56.25,74.56 55.24,75.56 55.24,96 56.25,97
  Bottom 0.3: IC2.3 28,15.25 28.25,15.5 34.61,15.5 34.61,30.8 34.92,31.11 39.85,31.11 40.96,32.23 64.61,32.23 v66.18,33.79 | v59.05,56.83 v63.18,52.7
BUFFERED_CAS*  (via drill 0.35)
  Top 0.3: v39.12,42.75 40.75,41.12 40.75,36.83 37.58,33.66 35.56,33.66 35.56,14.3 36.24,13.62 36.24,9.8 38.42,7.62 43.26,7.62 47.07,3.81 47.07,2.62 J2_DATA_AND_POWER_CON.9
  Top 0.305: v30.98,42.68 31.75,43.45 IC3.18
  Bottom 0.3: v39.12,42.75 31.05,42.75 v30.98,42.68
BUFFERED_IN*  (via drill 0.35)
  Top 0.3: v38.24,49.94 37.97,49.67 37.97,44.47 36.88,43.38 36.88,38.25 IC3.5 | v65.12,92.38 59.75,97.75 J1_ADDRESS_CON.17 | v58.42,68.26 v58.42,62.87
  Bottom 0.3: v38.24,49.94 38.31,49.88 53.5,49.88 54.88,48.5 56.88,48.5 58.16,49.79 58.16,62.61 v58.42,62.87 | v65.12,92.38 59.65,86.9 59.65,74.44 58.33,73.12 58.33,68.35 v58.42,68.26
BUFFERED_OUT*  (via drill 0.35)
  Top 0.3: v25.34,40 25.53,40.19 25.53,52.55 25.92,52.93 25.92,55.68 29.32,59.08 v29.32,60.51
  Bottom 0.3: v25.34,40 29.5,40 31.25,38.25 31.75,38.25 IC3.3 | J1_ADDRESS_CON.18 62.12,97.75 58.12,93.75 58.12,90.49 56.34,88.7 56.34,80.34 51.12,75.12 48.87,75.12 47.55,73.81 47.55,71.55 35.88,59.88 32.2,59.88 31.43,60.64 29.46,60.64 v29.32,60.51
BUFFERED_RAS*
  Top 0.3: J2_DATA_AND_POWER_CON.10 44.57,2.66 44.57,4.32 39.18,4.32 33.97,9.53 33.97,35.06 35.34,36.43 35.34,43.57 36.5,44.73 36.5,45.5 36.75,45.75 IC3.16
BUFFERED_RD*
  Top 0.3: IC4.22 46.99,70.48 46.99,47.87 47.95,46.91 47.95,39.37 46.99,38.41 IC3.9
  Bottom 0.3: J1_ADDRESS_CON.19 64.73,97.79 59.26,92.32 59.26,88.9 58.3,87.94 58.3,80.6 51.45,73.75 50.25,73.75 IC4.22
BUFFERED_WR*  (via drill 0.35)
  Top 0.3: v56.52,92.08 v62.55,92.08 | v70.33,52.7 68.9,51.28 v68.9,40.16
  Bottom 0.3: IC4.27 52.38,88.57 52.38,89.3 55.15,92.08 v56.52,92.08 | v62.55,92.08 62.55,92.71 67.31,97.47 J1_ADDRESS_CON.20 68.26,98.74 70.08,98.74 70.09,98.75 70.88,98.75 70.89,98.74 72.87,98.74 72.88,98.75 86.62,98.75 88.62,96.75 88.62,64.77 86.36,62.51 86.36,57.78 82.23,53.66 71.28,53.66 v70.33,52.7 | 44.57,40.44 46.5,42.38 51.47,42.38 53.47,40.38 57.1,40.38 58.18,39.29 59.93,39.29 60.96,38.26 68.58,38.26 68.9,38.58 v68.9,40.16
  Bottom 0.305: IC3.7 41.91,38.5 43.86,40.44 44.57,40.44
CAS*
  Bottom 0.3: IC3.2 29.21,36.28 28.26,35.25 13.99,35.25 11.9,37.34 10.96,37.34 10.29,36.67 10.29,35.05 9.68,34.45 9.68,30.32 U$1.P$3
D0  (via drill 0.35)
  Top 0.3: v31.8,61.82 33.48,63.5 IC4.11 | 9.84,14.29 11.75,14.29 12.54,13.49 12.54,12.22 | v1.59,58.74 3.49,60.64 v3.49,61.59
  Top 0.305: J2_DATA_AND_POWER_CON.20 19.05,5.71 12.54,12.22 | 9.84,14.29 3.49,14.29 v3.17,14.61
  Bottom 0.3: v31.8,61.82 31.73,61.75 12.89,61.75 11.9,62.74 8.6,62.74 U$1.P$30 v3.49,61.59 3.4,61.59 | 1.5,14.61 1.5,58.65 v1.59,58.74
  Bottom 0.305: v3.17,14.61 1.5,14.61
D1  (via drill 0.35)
  Top 0.3: J2_DATA_AND_POWER_CON.19 21.5,2.75 21.43,2.83 21.43,4.08 13.86,11.64 13.86,13.76 12.06,15.56 9.94,15.56 5.75,19.75 5.75,44.29 5.08,44.96 5.08,49.05 U$1.P$22 | IC4.12 33.81,59.85 32.54,59.85 26.99,54.29 26.99,52.27 v26.86,52.15
  Bottom 0.3: v26.86,52.15 13.73,52.15 13.34,51.75 12.73,51.75 11.9,52.58 8.6,52.58 U$1.P$22
D2  (via drill 0.35)
  Top 0.3: v27.25,5.75 30,8.5 30,8.57 30.05,8.62 30.05,35.36 29.84,35.56 | 28.58,53.33 33.75,58.5 34.75,58.5 34.83,58.42 IC4.13 | U$1.P$32 7.43,64.11 7.43,63.98 11.09,60.33 v13.97,60.33
  Top 0.305: 29.84,35.56 29.26,36.14 28.62,36.14 27.79,36.98 27.79,39.48 27.94,39.63 27.94,51.44 28.58,52.08 28.58,53.33
  Bottom 0.3: v27.25,5.75 24.25,2.75 J2_DATA_AND_POWER_CON.18
  Bottom 0.305: v13.97,60.33 15.88,58.42 IC4.13
D3  (via drill 0.35)
  Top 0.3: v17.14,55.24 9.84,55.24 8.57,56.52 U$1.P$26
  Bottom 0.3: IC4.15 50,55.75 48.5,55.75 46.45,53.7 32.07,53.7 31.27,54.5 17.89,54.5 v17.14,55.24 | 27.93,3.93 26.75,2.75 J2_DATA_AND_POWER_CON.17 | 25.53,8.75 15.75,8.75 12.88,11.62 12.88,13.79 11.72,14.95 9.55,14.95 4.37,20.14 4.37,55.59 5.29,56.52 U$1.P$26
  Bottom 0.305: 27.93,3.93 27.93,6.35 25.53,8.75
D4  (via drill 0.35)
  Top 0.3: 23.95,7.8 25.56,6.19 25.56,4.76 25.72,4.6 27.15,4.6 J2_DATA_AND_POWER_CON.16 | v17.25,51 17.25,46.35 | 17.25,46.35 17.25,42.5 16.5,41.75 16.5,21.59 18.73,19.36 21.4,19.36 22.58,18.18 | U$1.P$18 9.82,46.35 10.96,47.5 11.9,47.5 13.04,46.35 17.25,46.35
  Top 0.305: 23.95,7.8 23.95,13.51 22.58,14.88 22.58,18.18
  Bottom 0.3: v17.25,51 35.56,51 36.7,52.14 50.41,52.14 52.25,53.98 52.25,57.45 51.28,58.42 IC4.16
D5  (via drill 0.35)
  Top 0.3: v38.75,57 38.75,54.31 35.5,51.06 35.5,47.25 35.24,46.99 35.24,46.92 35.25,46.91 35.25,44.79 34.98,44.51 34.98,44.5 | 33,41.36 32.2,40.56 32.2,39.8 32.71,39.29 32.71,37.17 32.38,36.84 32.38,8.75 v35.63,5.5
  Top 0.305: 34.98,44.5 34.3,43.82 34.3,42.65 33,41.36
  Bottom 0.3: J2_DATA_AND_POWER_CON.15 31.86,2.54 34.18,4.87 35,4.87 v35.63,5.5 | v38.75,57 38.75,57.15 38.75,57.25 45.03,57.25 48.74,60.96 IC4.17 | U$1.P$28 9.23,57.28 10.58,57.28 10.96,57.66 11.9,57.66 12.28,57.28 13.47,57.28
  Bottom 0.305: 13.47,57.28 30.98,57.28 31.75,56.52 33.53,56.52 33.87,56.84 35.98,56.84 36.31,56.52 38.12,56.52 38.75,57.15
D6  (via drill 0.35)
  Top 0.3: v48.75,54.5 48.5,54.75 48.5,62 50,63.5 IC4.18 | 30.5,34.25 30.5,6.5 34.25,2.75 J2_DATA_AND_POWER_CON.14 | v30.75,53 30.75,44.75 29.21,43.21 29.21,40.25 28.56,39.6
  Top 0.305: 28.56,39.6 28.25,39.29 28.25,37.17 28.81,36.6 29.45,36.6 30.5,35.55 30.5,34.25
  Bottom 0.3: v48.75,54.5 47.5,53.25 30.75,53.25 v30.75,53 30.43,53.32 13.7,53.32 11.9,55.12 10.96,55.12 9.82,53.98 U$1.P$24
D7  (via drill 0.35)
  Top 0.3: 31,8.5 36.75,2.75 J2_DATA_AND_POWER_CON.13 | 33.33,43.11 32.97,42.75
  Top 0.305: 31,8.5 31,35.7 30.17,36.52 30.17,37.17 30.18,37.17 30.18,39.29 30.17,39.29 30.17,39.96 32.97,42.75 | v33,50.25 33.55,49.7 33.55,47.13 33.33,46.91 33.33,43.11
  Bottom 0.3: 33,50.5 18.07,50.5 17.6,50.04 16.8,50.04 15.88,50.96 12.83,50.96 11.91,50.04 8.6,50.04 U$1.P$20 | 33,50.5 36.83,50.5 37.47,51.14 51.1,51.14 54.88,54.93 54.88,61.37 50.25,66 IC4.19 | 33,50.5 v33,50.25
GND
  pour Top: 0,12.7 10.16,12.7 10.16,0 90.17,0 90.17,100.01 10.16,100.01 10.16,86.36 0.32,86.36 0,86.04
IN*  (via drill 0.35)
  Top 0.3: v19.05,47.31 19.05,46.51 v18.41,45.88
  Bottom 0.3: U$1.P$19 12.69,48.9 13.65,47.94 13.66,47.94 14.61,46.99 17.3,46.99 v18.41,45.88 | 25.08,47.96 24.12,46.99 20,46.99 19.68,47.31 v19.05,47.31
  Bottom 0.305: IC3.15 37.26,47.96 25.08,47.96
INT
  Top 0.3: IC5.8 69.22,62.87 66.99,60.64 61.59,60.64 61.28,60.33 61.28,55.57 60.6,54.89 60.6,54.25 IC8.1 56,49.5 56,47 IC8.2
INT0*
  Bottom 0.3: J1-INTERRUPTS.1 70.17,84.45 70.17,82.98 69.84,82.66 69.84,80.45 71.79,78.5 | IC5.12 70.17,73.54 71.79,75.17 71.79,78.5 | 71.79,78.5 72.36,79.07 77.58,79.07 77.59,79.06 78.9,79.06 80.96,81.12 RN2.2
INT1*
  Bottom 0.3: J1-INTERRUPTS.3 71.33,85.83 71.33,84.07 72.38,83.02 72.38,80.54 72.94,79.97 76.92,79.97 78.42,81.48 RN2.3 78.42,82.67 79.61,83.86 82.4,83.86 82.4,79.69 81.44,78.73 81.44,77.62 79.53,75.71 79.53,73.5 77.48,71.45 75.46,71.45 74.5,70.48 IC5.11
INT2*
  Top 0.3: IC5.6 69.2,72.06 71.23,72.06 74.42,75.25 74.42,78.03 75.88,79.49 RN2.4
  Bottom 0.3: J1-INTERRUPTS.5 69.85,89.07 71.78,87.14 71.78,84.26 72.82,83.22 73.74,83.22 74.31,82.66 74.31,81.91 74.61,81.6 RN2.4
INT3*
  Top 0.3: J1-INTERRUPTS.7 69.85,91.61 71.09,90.37 71.09,83.85 RN2.5 73.34,76.72 71.23,74.6 68.27,74.6 68.26,74.61 67.63,73.98 67.63,73.03 64.77,70.17 64.77,69.22 64.14,68.58 63.18,68.58 IC5.5
INT4*
  Top 0.3: IC5.1 63.18,78.74 RN2.9 63.18,84.14 63.5,84.45 66.99,84.45 J1-INTERRUPTS.2
INT5*
  Top 0.3: IC5.2 65.72,78.74 RN2.8
  Bottom 0.3: J1-INTERRUPTS.4 65.72,85.72 RN2.8
INT6*
  Top 0.3: IC5.3 67.31,77.79 67.31,80.64 RN2.7
  Bottom 0.3: J1-INTERRUPTS.6 60.64,83.19 60.64,73.34 62.23,73.34 IC5.3
INT7*
  Top 0.3: IC5.4 67.63,75.56 67.63,76.52 68.26,77.15 68.26,79.38 70.17,79.38 70.8,80.01 RN2.6
  Bottom 0.3: J1-INTERRUPTS.8 67.31,91.61 68.55,90.37 68.55,83.91 67.3,82.66 67.3,80.54 67.31,80.53 67.31,75.25 65.41,73.34 65.41,72.23 63.66,70.48 IC5.4
INT*  (via drill 0.35)
  Top 0.3: v15.24,48.9 12.7,51.44 U$1.P$21
  Bottom 0.3: IC8.3 55.86,44.43 53.99,44.43 49.68,48.74 29.78,48.74 29.61,48.57 23.41,48.57 23.09,48.9 v15.24,48.9
INTAK*  (via drill 0.35)
  Top 0.305: v35.56,13.34 v35.56,10.16
  Bottom 0.3: 49.25,4.25 50.75,4.25 52.25,2.75 J2_DATA_AND_POWER_CON.7 | U$1.P$14 7.12,41.27 5.5,39.66 5.5,23.07 14.91,13.65 16.74,13.65 16.75,13.66 35.23,13.66 v35.56,13.34 | 38.97,5.16 48.34,5.16
  Bottom 0.305: 48.34,5.16 49.25,4.25 | 38.97,5.16 35.56,8.57 v35.56,10.16
N$1
  Bottom 0.508: L1.1 57.94,12.42 | 57.94,12.42 D2-1N5824.C | IC6.2 54.75,12.42 57.94,12.42
N$20
  Top 0.3: R7.2 73.84,97.79 77.02,94.61 D1.A
OUT*
  Bottom 0.3: U$1.P$12 7.43,38.76 7.43,38.89 11.09,42.55 28.89,42.55 30.32,43.97 34.13,43.97 34.29,44.13 IC3.17
RAS
  Top 0.3: IC8.8 61.96,34.29 61.02,35.23 61.02,44.77 63,46.75 63.5,46.75 IC8.13
RAS*  (via drill 0.35)
  Top 0.3: IC8.9 IC8.10 | v13.97,39.37 13.81,39.21 13.81,36.07 12.54,34.8 10.96,34.8 10.29,34.13 10.29,27.18 U$1.P$1
  Bottom 0.3: 61.5,35.5 62.75,36.75 63.5,36.75 IC8.9 | IC3.4 34.5,38.25 32,40.75 15.88,40.75 14.49,39.37 v13.97,39.37
  Bottom 0.305: 61.5,35.5 52.77,35.5 52.07,36.2 36.55,36.2 34.5,38.25
RD*  (via drill 0.35)
  Top 0.3: v20.64,45.72 v20.64,55.88 | v32.38,55.24 33.66,53.98 35.88,53.98 37.47,55.56 37.47,57.78 38.1,58.42 39.37,58.42 40.3,57.49 40.3,56.52 39.69,55.91 39.69,48.5 v40.24,47.94
  Bottom 0.3: U$1.P$15 18.73,43.81 v20.64,45.72 | v20.64,55.88 20.95,55.56 32.07,55.56 v32.38,55.24 | v40.24,47.94 47.43,47.94 IC3.11
SYSRES*  (via drill 0.35)
  Top 0.3: 17.25,14.25 7.46,24.04 U$1.P$2
  Top 0.305: 17.25,14.25 18.69,12.81 18.69,12.3 19.26,11.73 21.38,11.73 22.26,12.62 v22.89,12.62
  Bottom 0.3: v22.89,12.62 29.25,6.25 35.96,6.25 37.96,4.25 47.5,4.25 49,2.75 49.5,2.75 J2_DATA_AND_POWER_CON.8
VCC
  pour Bottom: 10.16,100.01 10.16,86.36 0,86.36 0,12.7 10.16,12.7 10.16,0 90.17,0 90.17,100.01
VCC/2
  Bottom 0.3: J2_DATA_AND_POWER_CON.3 60.96,3.81 51.83,3.81 50.94,4.7 49.55,4.7 45.23,9.02 42.55,9.02 | 42.55,9.02 C1.+ | LD1117V33.GND 42.55,9.02
WAIT
  Top 0.3: IC8.5 IC8.4
  Bottom 0.3: IC8.4 57.27,41.91 58.24,40.95 65.09,40.95 65.09,41.48 65.12,41.51 65.12,49.93 65.09,49.97 65.09,55.56 82.03,55.56 82.72,56.25 82.72,61.45 IC10.8
WAIT0*  (via drill 0.35)
  Top 0.3: v82.01,74.38 78.88,77.51 78.88,78.89 77.44,80.32 77.44,82.93 75.62,84.75 J2-WAITS.8 | IC10.4 78.11,70.48 78.59,70 78.59,64.82 77.76,63.99 75.1,63.99 74.89,63.78 74.89,61.59 76.2,60.29 RN1.6
  Bottom 0.3: v82.01,74.38 81.12,74.38 77.25,70.5 76.62,70.5 IC10.4
WAIT1*  (via drill 0.35)
  Top 0.3: RN1.7 78.74,64.33 79.05,64.63 79.05,71.45 77.47,73.03 IC10.3 | v79.94,78.38 79.94,82.93 75.62,87.25 J2-WAITS.6
  Bottom 0.3: v79.94,78.38 78.25,76.68 78.25,74.75 76.62,73.12 IC10.3
WAIT2*
  Top 0.3: RN1.8 81.28,68.26 80.33,69.22 80.33,71.75 IC10.2
  Bottom 0.3: J2-WAITS.4 75.5,89.88 74.25,91.12 71.75,91.12 71.75,93.5 74.12,95.88 79.38,95.88 79.38,95.79 80.52,94.65 80.52,90.69 86.75,84.45 86.75,65 85.62,63.88 82.01,63.88 81.38,63.24 81.38,58.12 RN1.8
WAIT3*  (via drill 0.35)
  Top 0.3: RN1.9 83.82,61.16 82.51,62.47 82.51,66.71 | IC10.1 81.92,72.71 81.92,69.22 82.51,68.62 82.51,66.71 | 82.51,66.71 v82.55,66.67
  Bottom 0.3: J2-WAITS.2 81.49,86.47 83.08,86.47 86.21,83.34 86.21,67.2 85.67,66.67 v82.56,66.67 v82.55,66.67
WAIT4*  (via drill 0.35)
  Top 0.3: J2-WAITS.7 73.03,85.56 74.27,86.8 74.27,87.83 73.54,88.56 72.57,88.56 71.78,89.34 71.78,90.45 71.33,90.91 71.33,93.24 72.17,94.09 74.22,94.09 74.68,94.54 76.45,94.54 77.7,93.3 80.39,93.3 88.22,85.47 88.22,74.44 87.31,73.54 87.31,55.72 v87.63,55.4 | IC10.5 78.14,66.32 78.14,65.01 77.58,64.44 74.28,64.44 73.66,63.82 RN1.5 73.66,56.99 74.77,55.88 83.82,55.88 v85.72,53.98
  Bottom 0.3: v85.72,53.98 87.15,55.4 v87.63,55.4
WAIT5*
  Top 0.3: IC10.6 73.5,65.41 72.39,64.29 72.39,61.12 71.12,59.85 RN1.4
  Bottom 0.3: IC10.6 77.03,65.92 77.67,65.92 80.46,68.71 80.46,71.57 80.83,71.94 85.07,71.94 85.76,72.63 85.76,83.15 82.89,86.02 74.32,86.02 J2-WAITS.5
WAIT6*
  Top 0.3: IC10.11 84.14,71 87.77,74.63 87.77,85.28 80.2,92.84 77.51,92.84 76.27,94.09 74.86,94.09 74.41,93.64 72.36,93.64 71.78,93.06 71.78,91.09 J2-WAITS.3
  Bottom 0.3: RN1.3 70.7,60.23 75.9,60.23 78.14,62.47 78.14,63.98 | IC10.11 83.5,70.48 81.64,68.62
  Bottom 0.305: 81.64,68.62 81.64,67.59 78.14,64.09 78.14,63.98
WAIT7*
  Top 0.3: IC10.12 85.41,73.03 87.31,74.93 87.31,85.09 80.01,92.39 77.32,92.39 76.08,93.64 75.05,93.64 74.6,93.18 73.18,93.18 73.03,93.03 J2-WAITS.1
  Bottom 0.3: RN1.2 66.04,58.42 68.93,61.31 71.04,61.31 74.89,65.17 74.89,65.8 75.46,66.37 77.48,66.37 80.01,68.9 80.01,71.75 80.64,72.39 83.5,72.39 IC10.12
WAIT*  (via drill 0.35)
  Top 0.3: v13.34,41.27 13.04,41.27 11.64,42.67 10.64,42.67 8.1,45.21 6.99,45.21 6.32,45.88 6.32,46.83 6.99,47.5 8.42,47.5 9.02,48.1 9.02,54.32 7.96,55.37 6.99,55.37 6.32,56.04 6.32,64.61 6.99,65.28 10.03,65.28 U$1.P$33 | v46.67,40.64 44.93,40.64 v43.97,41.59
  Bottom 0.3: IC8.6 55.24,37.47 53.34,37.47 50.16,40.64 v46.67,40.64 | v13.34,41.27 13.64,41.27 13.69,41.32 33.02,41.32 33.7,40.64 42.55,40.64 43.46,41.56 43.94,41.56 v43.97,41.59
WR*
  Bottom 0.3: U$1.P$13 11.43,41.28 12.1,41.96 38.1,41.96 38.46,41.59 40.2,41.59 IC3.13

### Text on the board
tNames: A0 | A2 | A4 | A6 | A8 | A10 | A12 | A14 | IN* | RD* | A1 | A3 | A5 | A7 | A9 | A11 | A13 | A15 | OUT* | WR* | INT* | WAIT* | 4.7k | 74LS244 | 74LS30 | 74LS30 | 4.7k | 62256 | 74LS244 | 74LS00 | TRS80MXS Base - V1.4 / Joe Rounceville (C) 2020 | 74LS244 | 10uf | RAS* | D1 | D3 | D5 | D7 | CAS* | D0 | D2 | D4 | D6 | RES* | INTAK* | 3.3V | GND | 5V